# EAGLE design doogie_board (EAGLE 9.4.2)

## Sheet 1 of 3
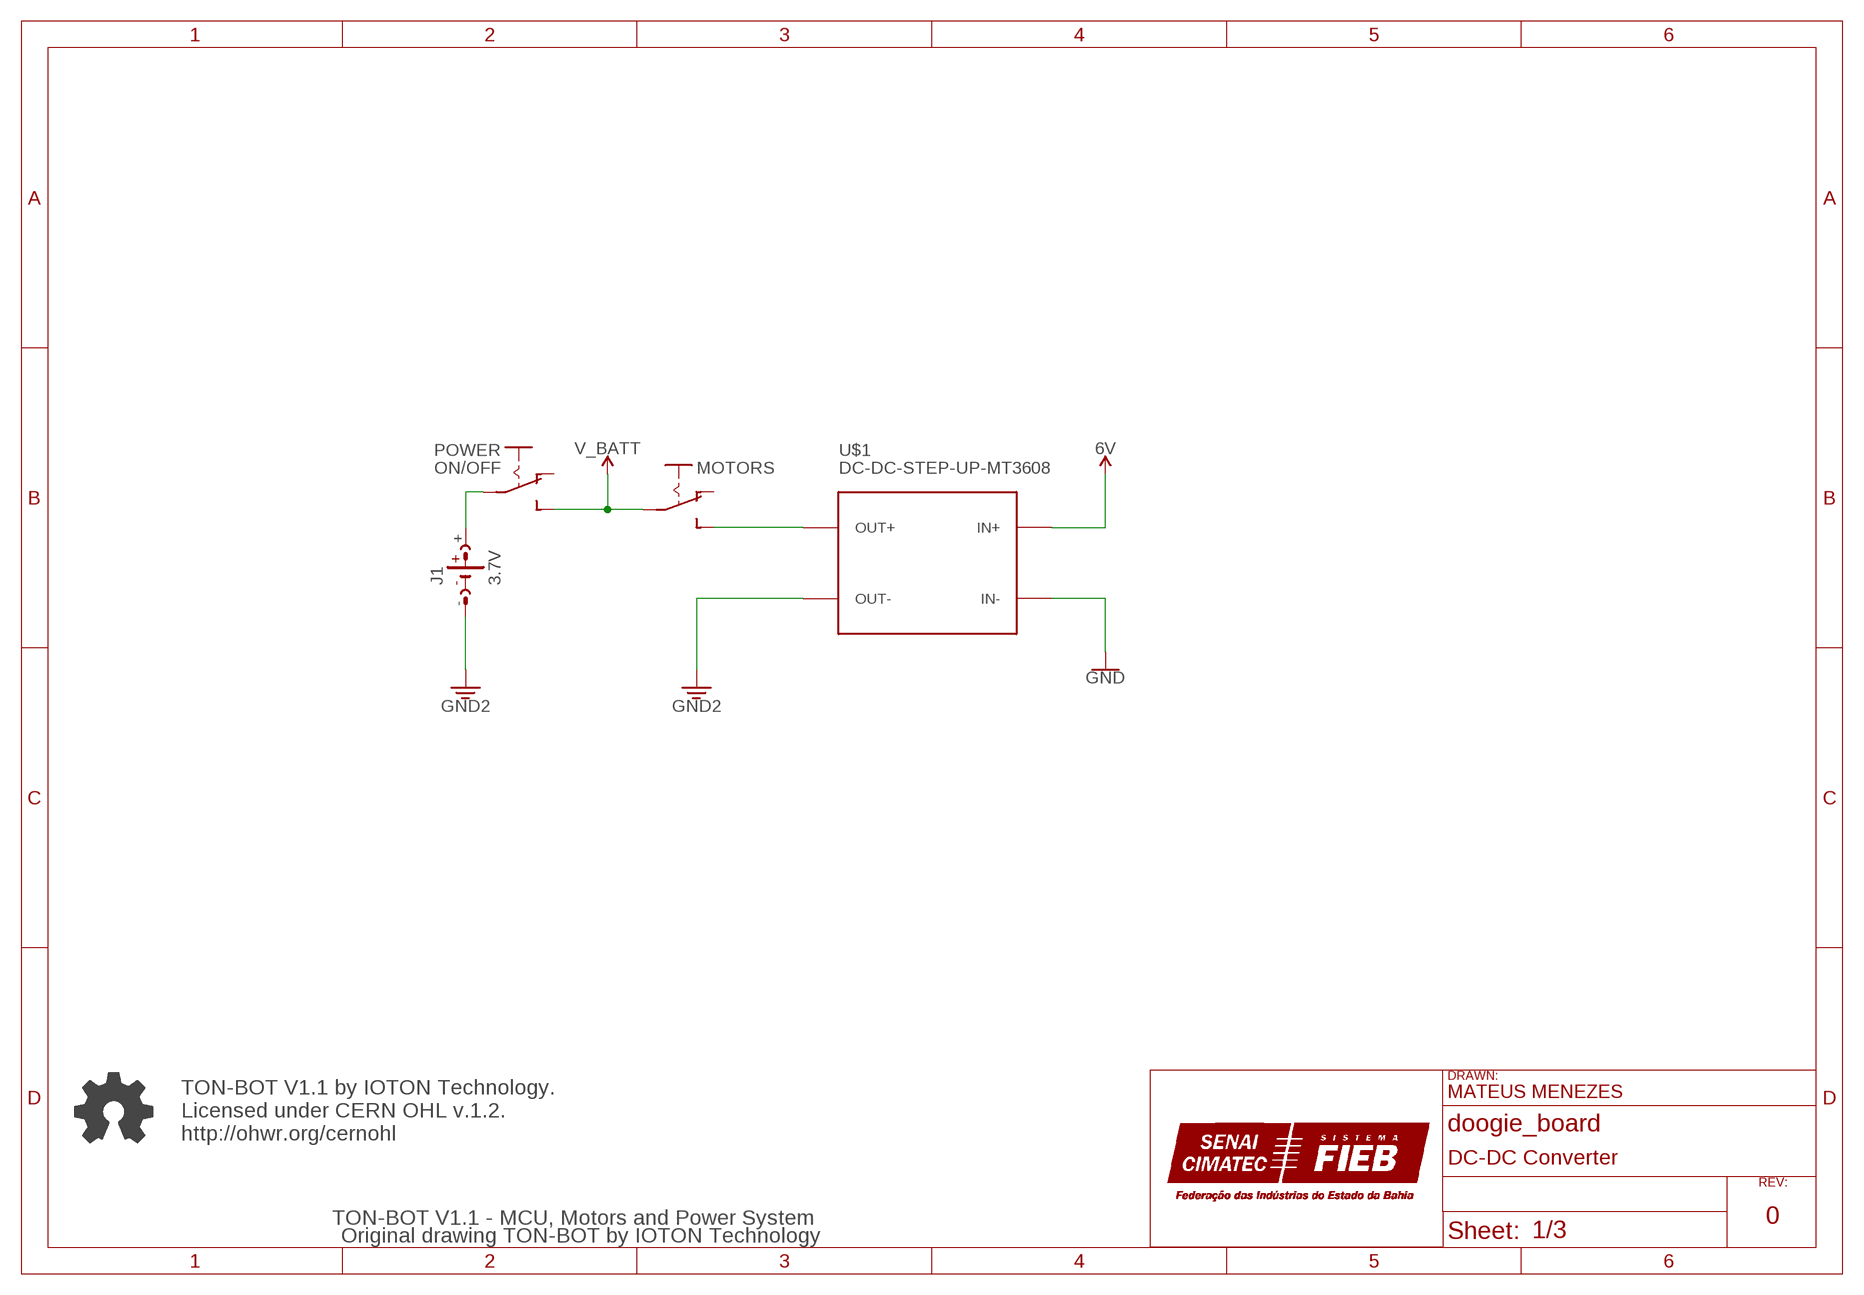
[diagram p0: schematic, sheet 1]

### Parts
J1  3.7V  BATTERY  [BATTERY]
MOTORS  SWITCHS  [SWITCH]
POWER  ON/OFF  SWITCHS  [SWITCH]
U$1  DC-DC-STEP-UP-MT3608  [DC-DC-STEP-UP-MT3608]
U$2  FRAME_A4P  [FRAME_A4P]

### Nets
3.3V: J1.- U$1.OUT- ; supply symbol labelled GND2 ; also sheet 3
GND: U$1.IN- ; also sheet 3
N$5: MOTORS.S U$1.OUT+
N$17: J1.+ POWER.P
V_BATT: MOTORS.P POWER.S
VCC_1: U$1.IN+ ; supply symbol labelled 6V
Unconnected: MOTORS.O POWER.O

### Notes on the sheet
- TON-BOT V1.1 by IOTON Technology.
  Licensed under CERN OHL v.1.2.
  http://ohwr.org/cernohl
- TON-BOT V1.1 - MCU, Motors and Power System
- Original drawing TON-BOT by IOTON Technology

## Sheet 2 of 3
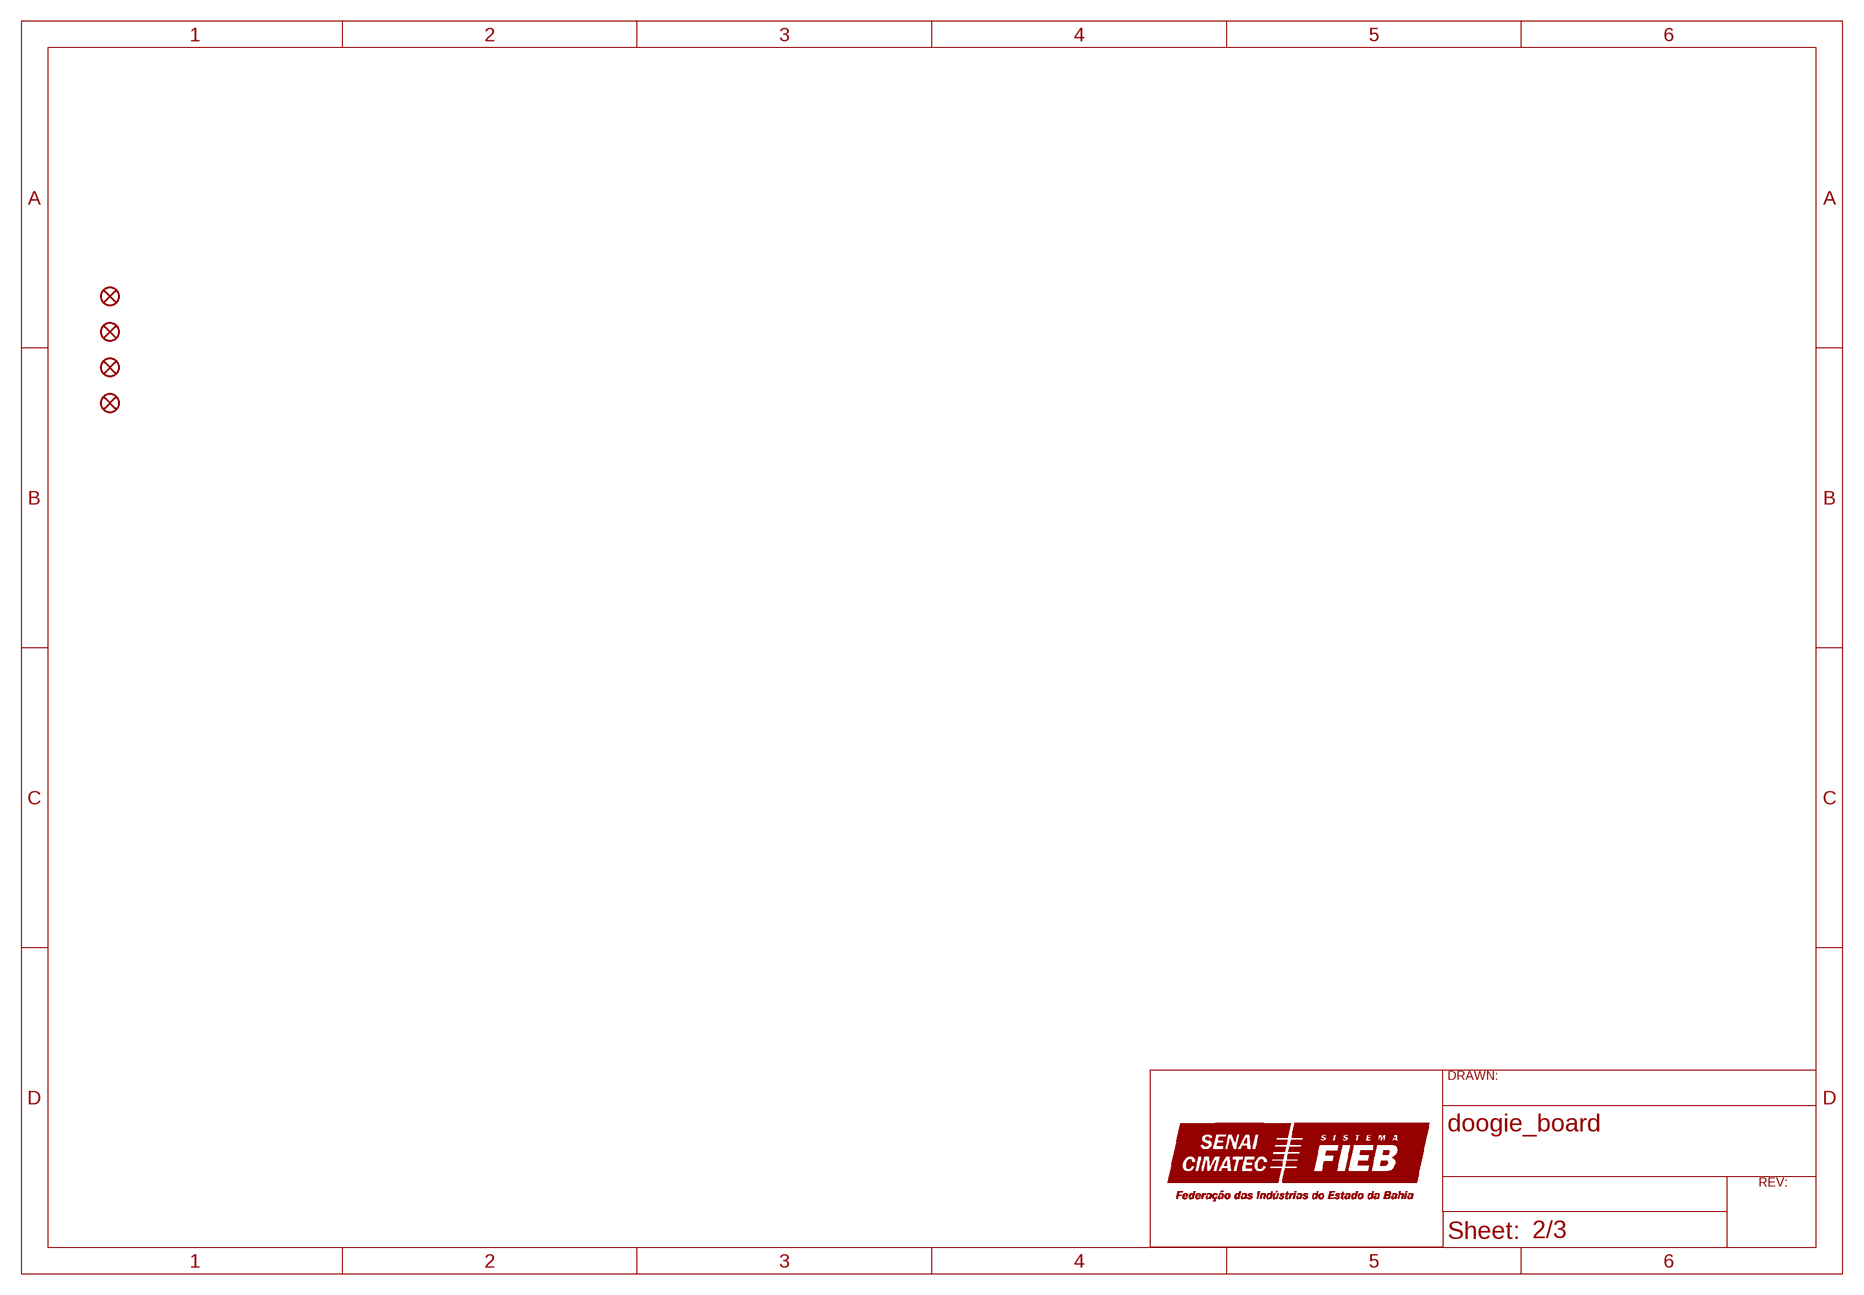
[diagram p1: schematic, sheet 2]

### Parts
JP1  FIDUCIAL1X2  [FIDUCIAL-1X2]
JP2  FIDUCIAL1X2  [FIDUCIAL-1X2]
JP3  FIDUCIAL1X2  [FIDUCIAL-1X2]
JP4  FIDUCIAL1X2  [FIDUCIAL-1X2]
U$3  FRAME_A4P  [FRAME_A4P]

## Sheet 3 of 3
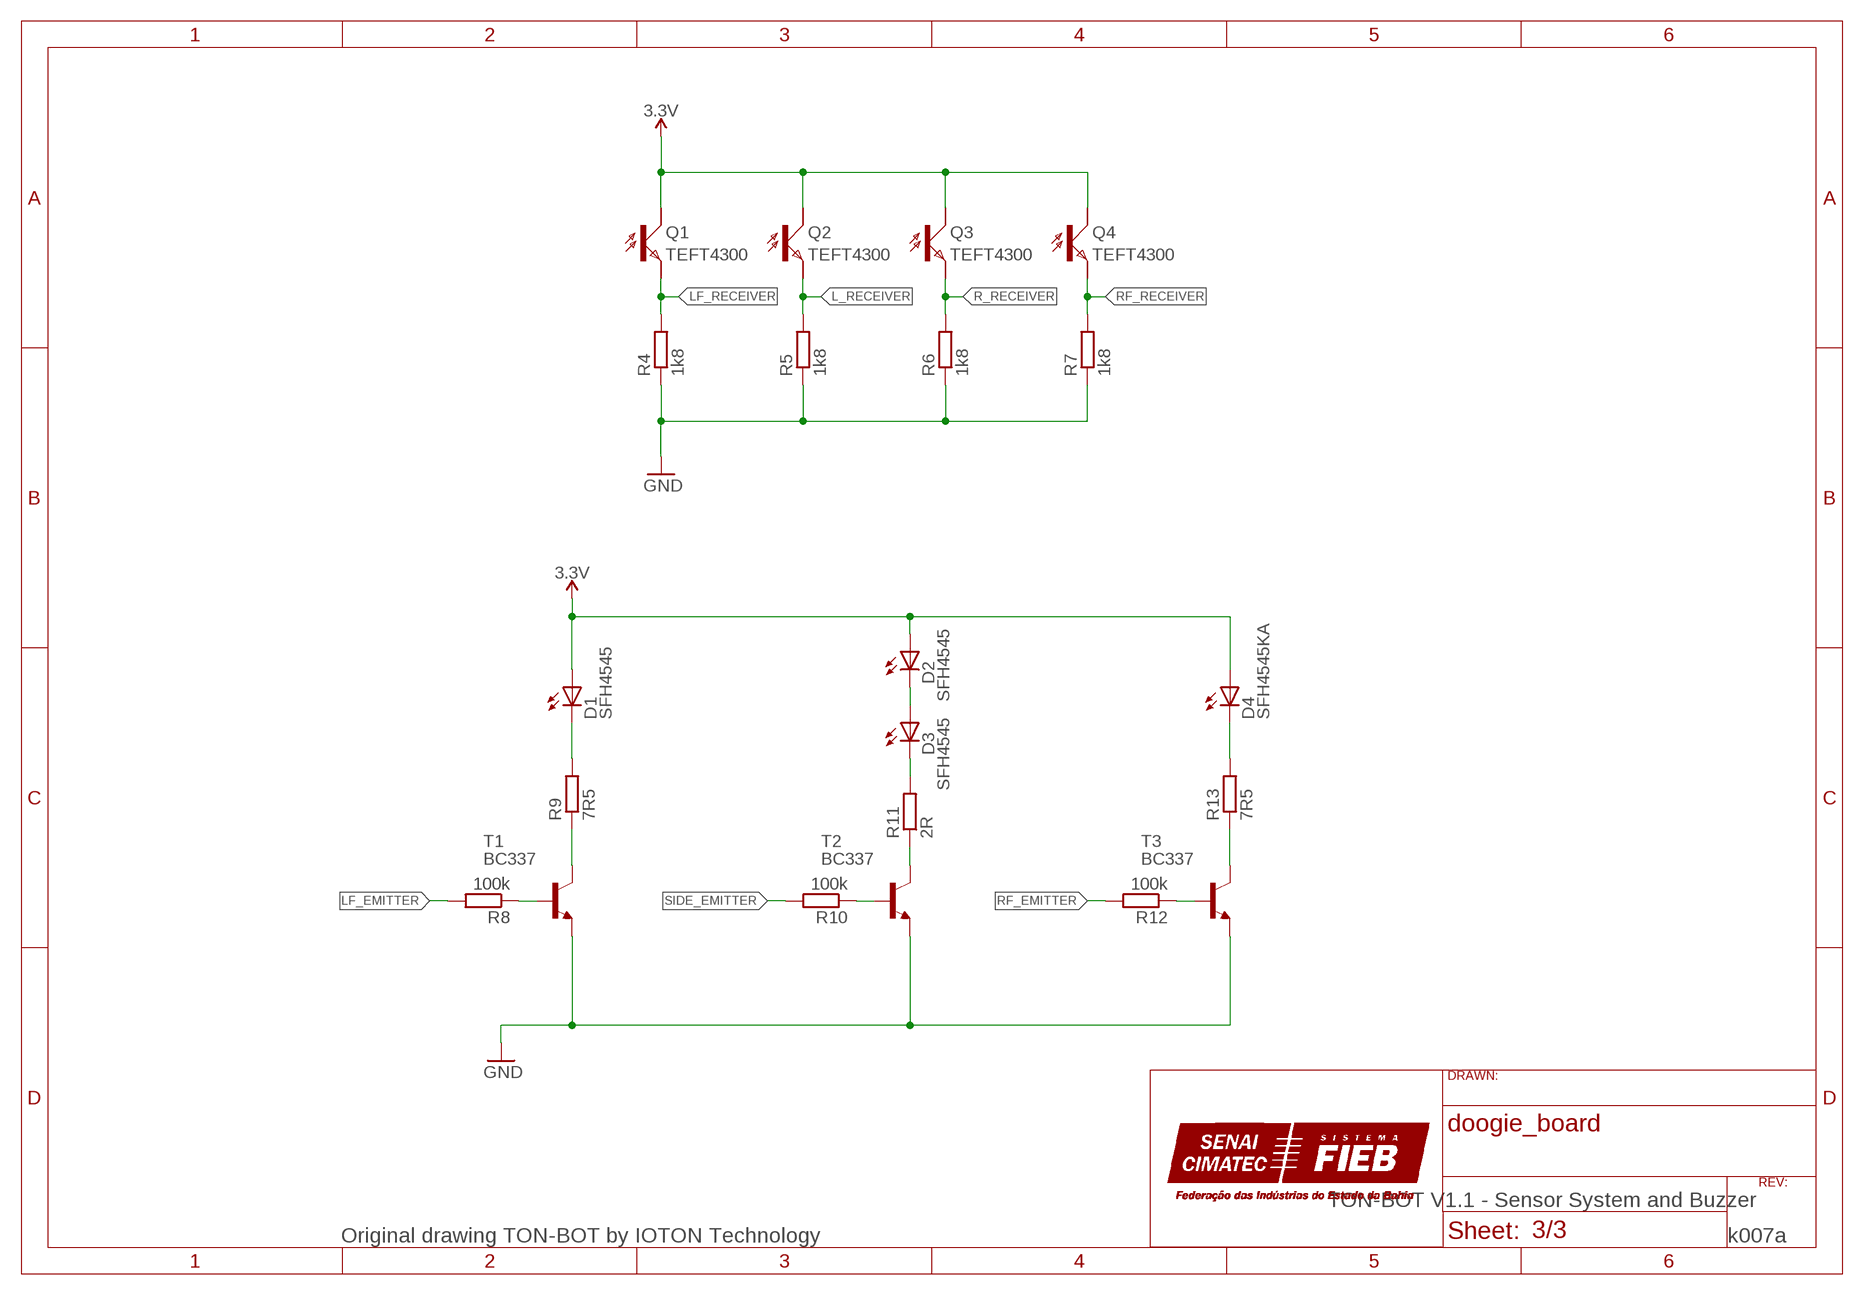
[diagram p2: schematic, sheet 3]

### Parts
D1  SFH4545  SFH4545AK  [SFH4545-AK]
D2  SFH4545  SFH4545KA  [SFH4545-KA]
D3  SFH4545  SFH4545KA  [SFH4545-KA]
D4  SFH4545KA  [SFH4545-KA]
Q1  TEFT4300  TEFT4300CE  [TEFT4300-CE]
Q2  TEFT4300  TEFT4300EC  [TEFT4300-EC]
Q3  TEFT4300  TEFT4300CE  [TEFT4300-CE]
Q4  TEFT4300  TEFT4300EC  [TEFT4300-EC]
R4  1k8  R-EU_0204/7  [0204/7]
R5  1k8  R-EU_0204/7  [0204/7]
R6  1k8  R-EU_0204/7  [0204/7]
R7  1k8  R-EU_0204/7  [0204/7]
R8  100k  R-EU_0204/7  [0204/7]
R9  7R5  R-EU_0204/7  [0204/7]
R10  100k  R-EU_0204/7  [0204/7]
R11  2R  R-EU_0204/7  [0204/7]
R12  100k  R-EU_0204/7  [0204/7]
R13  7R5  R-EU_0204/7  [0204/7]
T1  BC337  [TO92]
T2  BC337  [TO92]
T3  BC337  [TO92]
U$4  FRAME_A4P  [FRAME_A4P]

### Nets
3.3V: D1.A D2.A D4.A Q1.C Q2.C Q3.C Q4.C ; also sheet 1
GND: R4.1 R5.1 R6.1 R7.1 T1.1(E) T2.1(E) T3.1(E) ; also sheet 1
L_RECEIVER: Q2.E R5.2
LF_EMITTER: R8.2
LF_RECEIVER: Q1.E R4.2
N$1: R9.1 T1.3(C)
N$2: R11.1 T2.3(C)
N$3: R13.1 T3.3(C)
N$4: R8.1 T1.2(B)
N$6: R10.1 T2.2(B)
N$7: R12.1 T3.2(B)
N$14: D2.K D3.A
N$15: D1.K R9.2
N$16: D4.K R13.2
N$20: D3.K R11.2
R_RECEIVER: Q3.E R6.2
RF_EMITTER: R12.2
RF_RECEIVER: Q4.E R7.2
SIDE_EMITTER: R10.2

### Notes on the sheet
- TON-BOT V1.1 - Sensor System and Buzzer
- Original drawing TON-BOT by IOTON Technology | k007a

## Library data of the parts
D1-D4 = maze:SFH4545
J1 = pololu:BATTERY: BATTERY CLIP
JP1-JP4 = SparkFun:FIDUCIAL: Fiducial Alignment Points Various fiducial points for machine vision alignment.
MOTORS POWER = pololu:SWITCH: SLIDING SWITCH 0.1" spacing through hole, vertical SPDT slide switch http://www.ladyada.net/library/pcb/eaglelibrary.html
Q1-Q4 = maze:TEFT4300
R4-R13 = rcl:R-EU_: RESISTOR, European symbol; SPICEPREFIX: R
T1-T3 = transistor:BC337: NPN TRANSISTOR
U$1 = diy-modules:DC-DC-STEP-UP-MT3608: DC/DC Step-Up Regulator based on MT3608 chip MT3608 datasheet available here: https://www.olimex.com/Products/Breadboarding/BB-PWR-3608/resources/MT3608.pdf Click here to find device on ebay.com <http://www.ebay.com/sch/mt3608+module>
U$2 = doogie:FRAME_A4P: BIR Frame A4 landscape; DESIGNER_NAME: MATEUS MENEZES; PAGE_DESCRIPTION: DC-DC Converter; REV_NUMBER: 0
U$3 U$4 = doogie:FRAME_A4P: BIR Frame A4 landscape

## Board
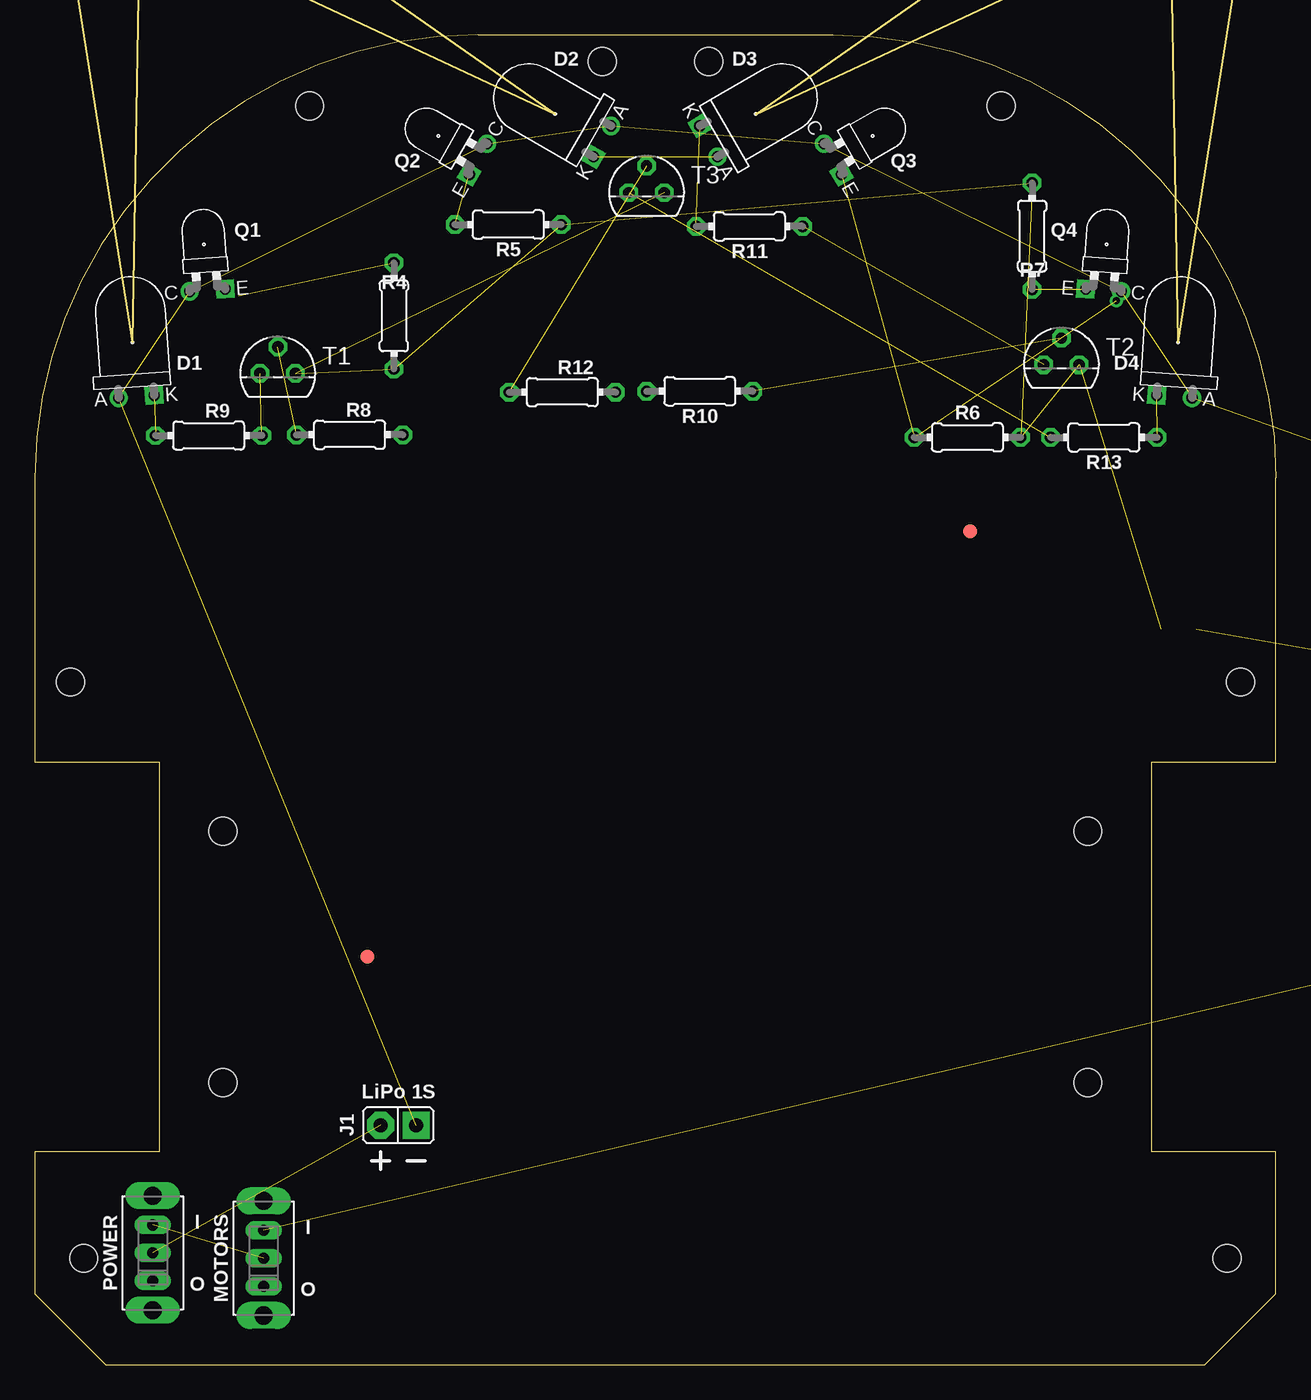
[diagram p3: board, top side]
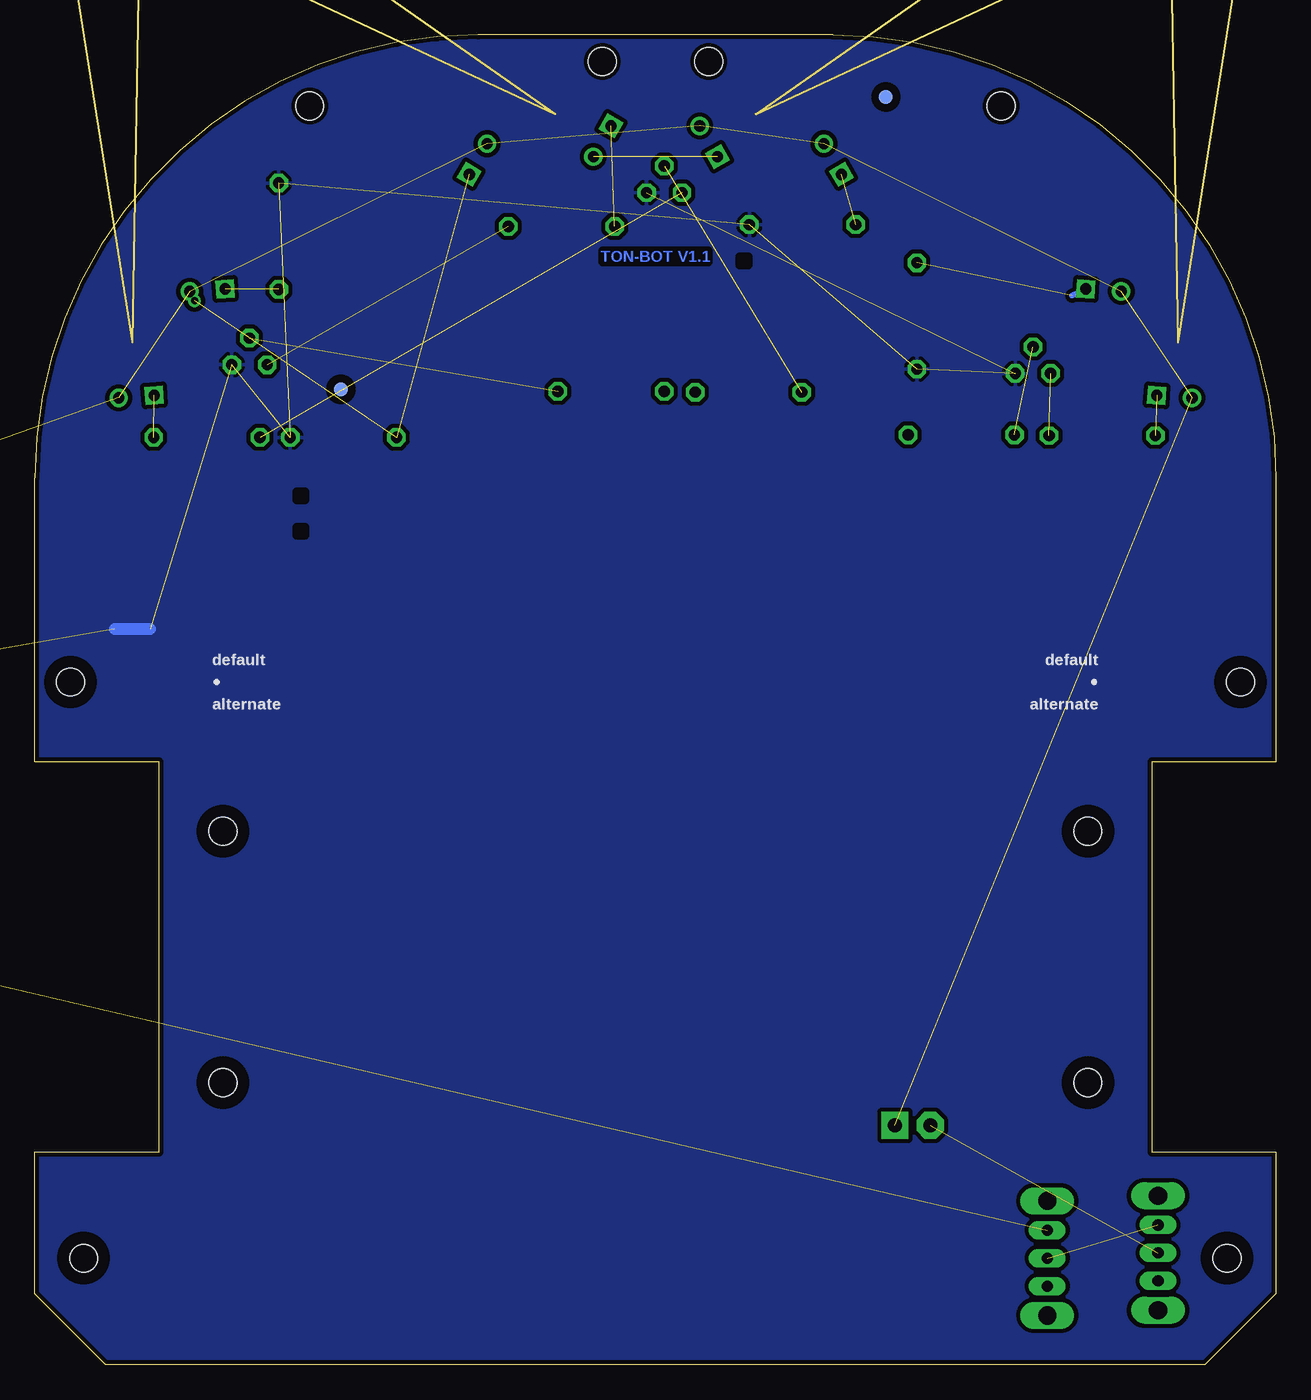
[diagram p4: board, bottom side, seen from below]

Size 88.9 x 95.25 mm. Coordinates in mm from the lower left corner, seen from the top.
Outline: 0,15.24 0,5.08 5.08,0 83.82,0 88.9,5.08 88.9,15.24 80.01,15.24 80.01,43.18 88.9,43.18 88.9,63.5 arc90 57.15,95.25 31.75,95.25 arc90 0,63.5 0,43.18 8.89,43.18 8.89,15.24 0,15.24
Copper layers (1*16): Top 0.035mm / dielectric 1.5mm / Bottom 0.035mm
Design rules "default": minimum track width 8mil, minimum drill 19mil, track to track 8mil, track to pad 8mil, pad to pad 8mil, via to via 8mil, smd to smd 8mil, copper to edge 10mil, drill to drill 8mil, minimum pad ring 10mil, minimum via ring 8mil, stop-mask expansion 4mil, vias tented up to drill 20mil, thermal gap 10mil
Holes 2 mm at 13.47,38.21 13.47,20.21 75.43,20.21 75.43,38.21 48.26,93.34 40.64,93.34 19.69,90.17 69.22,90.17 2.54,48.89 86.36,48.89 3.49,7.62 85.41,7.62
tRestrict: area 23.1,28.5 to 24.6,30; area 66.2,58.9 to 67.7,60.4
bRestrict: area 1.1,47.5 to 4,50.3; area 84.9,47.5 to 87.8,50.3; area 2.1,6.2 to 4.9,9; area 84,6.2 to 86.8,9; area 12,18.8 to 14.9,21.6; area 12,36.8 to 14.9,39.6; area 74,36.8 to 76.9,39.6; area 74,18.8 to 76.9,21.6; area 69.5,61.9 to 70.2,62.5; area 69.5,59.4 to 70.2,60; area 37.8,78.7 to 38.4,79.4; area 27.2,90.1 to 28.7,91.6; area 66.2,69.1 to 67.7,70.6

### Footprints (pad centres in the part's own frame; a part is rotated, then mirrored left to right if it is on the bottom)
SFH4545-AK = drill 0.8: A -1.27,0 | drill 0.8 square: K 1.27,0
SFH4545-KA = drill 0.8: A 1.27,0 | drill 0.8 square: K -1.27,0
BATTERY = drill 1 pad 1.93 octagon: + 0,1.27 | drill 1 pad 1.93 square: - 0,-1.27
FIDUCIAL-1X2 = smd 1 x 1: 1 0,0
SWITCH = drill 0.8 pad 1.27 long: O -2,0; P 0,0; S 2,0 | drill 1.3 long: P$1 -4.1,0; P$2 4.1,0
TEFT4300-CE = drill 0.8: C -1.27,0 | drill 0.8 square: E 1.27,0
TEFT4300-EC = drill 0.8: C 1.27,0 | drill 0.8 square: E -1.27,0
0204/7 = drill 0.813 octagon: 1 -3.81,0; 2 3.81,0
TO92 = drill 0.813 octagon: 1 1.27,0; 2 0,1.905; 3 -1.27,0
DC-DC-STEP-UP-MT3608 = drill 2 pad 2.8 square: IN+ 15.24,3.81; IN- 15.24,-3.81; OUT+ -15.24,3.81; OUT- -15.24,-3.81

### Placement (x,y rotation side)
D1  7.27,69.34 4 top
D2  40.64,87.63 60 top
D3  48.26,87.63 300 top
D4  81.63,69.34 356 top
J1  26.04,17.15 90 top
JP1  66.99,59.69 0 top
JP2  23.81,29.21 0 top
JP3  66.99,69.85 0 bottom
JP4  27.94,90.81 0 bottom
MOTORS  16.38,7.62 90 top
POWER  8.45,8 90 top
Q1  12.35,76.96 4 top
Q2  31.75,86.36 60 top
Q3  57.15,86.36 300 top
Q4  76.55,76.96 356 top
R4  25.72,75.12 90 top
R5  33.91,81.66 180 top
R6  66.8,66.42 180 top
R7  71.44,80.84 270 top
R8  22.54,66.61 0 top
R9  12.45,66.55 180 top
R10  47.62,69.72 180 top
R11  51.18,81.53 180 top
R12  37.78,69.66 0 top
R13  76.58,66.42 0 top
T1  17.4,70.99 0 top
T2  73.53,71.63 0 top
T3  43.82,83.95 0 top
U$1  129.54,43.43 180 top  (outside the outline)
U$2  -30.1,68.33 0 top  (outside the outline)
U$3  -31.11,67.31 0 top  (outside the outline)
U$4  -32.13,66.29 0 top  (outside the outline)

### Tracks (layer width: path | path; a pad name or v marks a point on that pad's centre or on a via)
3.3V  (8 unrouted)
GND  (8 unrouted)
  Bottom 0.813: 80.65,52.7 83.19,52.7
  pour Bottom (isolate 0.305, rank 3): 0,95.25 0,0 88.9,0 88.9,95.25
L_RECEIVER  (1 unrouted)
LF_RECEIVER  (1 unrouted)
  Bottom 0.406: 14.61,76.57 Q1.E
N$1  (1 unrouted)
N$2  (1 unrouted)
N$3  (1 unrouted)
N$4  (1 unrouted)
N$5  (1 unrouted)
N$6  (1 unrouted)
N$7  (1 unrouted)
N$14  (1 unrouted)
N$15  (1 unrouted)
N$16  (1 unrouted)
N$17  (1 unrouted)
N$20  (1 unrouted)
R_RECEIVER  (via drill 0.5)  (2 unrouted)
  other vias: 77.47,76.2
RF_RECEIVER  (1 unrouted)
V_BATT  (1 unrouted)

### Text on the board
Bottom: TON-BOT V1.1
tPlace: LiPo 1S | I | I | O | O
bPlace: default | default | alternate | alternate
tDocu: TON-BOT V1.1 by IOTON Technology. / Licensed under CERN OHL v.1.2. / http://ohwr.org/cernohl